# Altium schematic sheet Sheet7.SchDoc
size A4
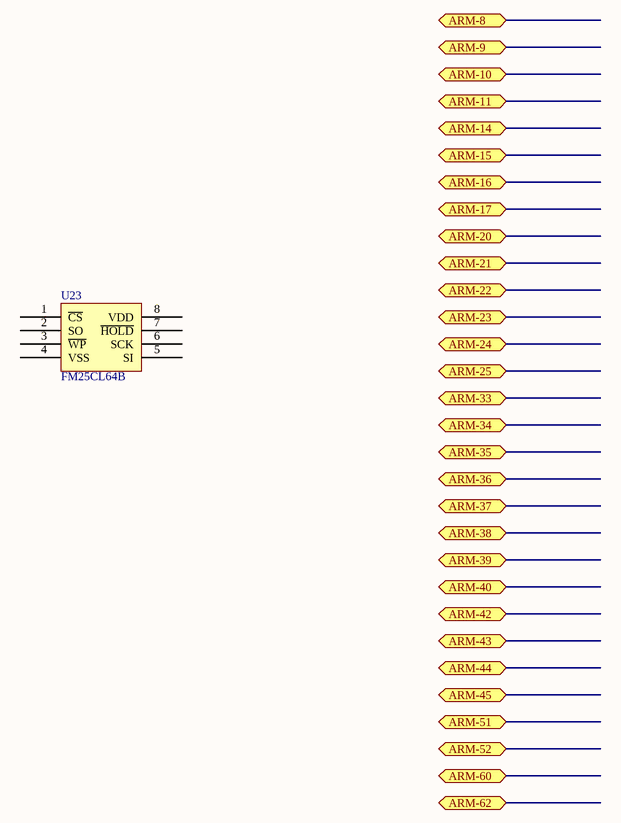
[diagram p0: Sheet7.SchDoc]

## Parts
U23  FM25CL64B

## Ports
ARM-8, ARM-9, ARM-10, ARM-11, ARM-14, ARM-15, ARM-16, ARM-17, ARM-20, ARM-21, ARM-22, ARM-23, ARM-24, ARM-25, ARM-33, ARM-34, ARM-35, ARM-36, ARM-37, ARM-38, ARM-39, ARM-40, ARM-42, ARM-43, ARM-44, ARM-45, ARM-51, ARM-52, ARM-60, ARM-62

## Nets

Not connected (* = marked no-connect by the designer): U23 1(~{CS}) 2(SO) 3(~{WP}) 4(VSS) 5(SI) 6(SCK) 7(~{HOLD}) 8(VDD)

## Library data of the parts
U23 = Component_1